# EAGLE schematic octanis_eps_compact (EAGLE 7.1.0)
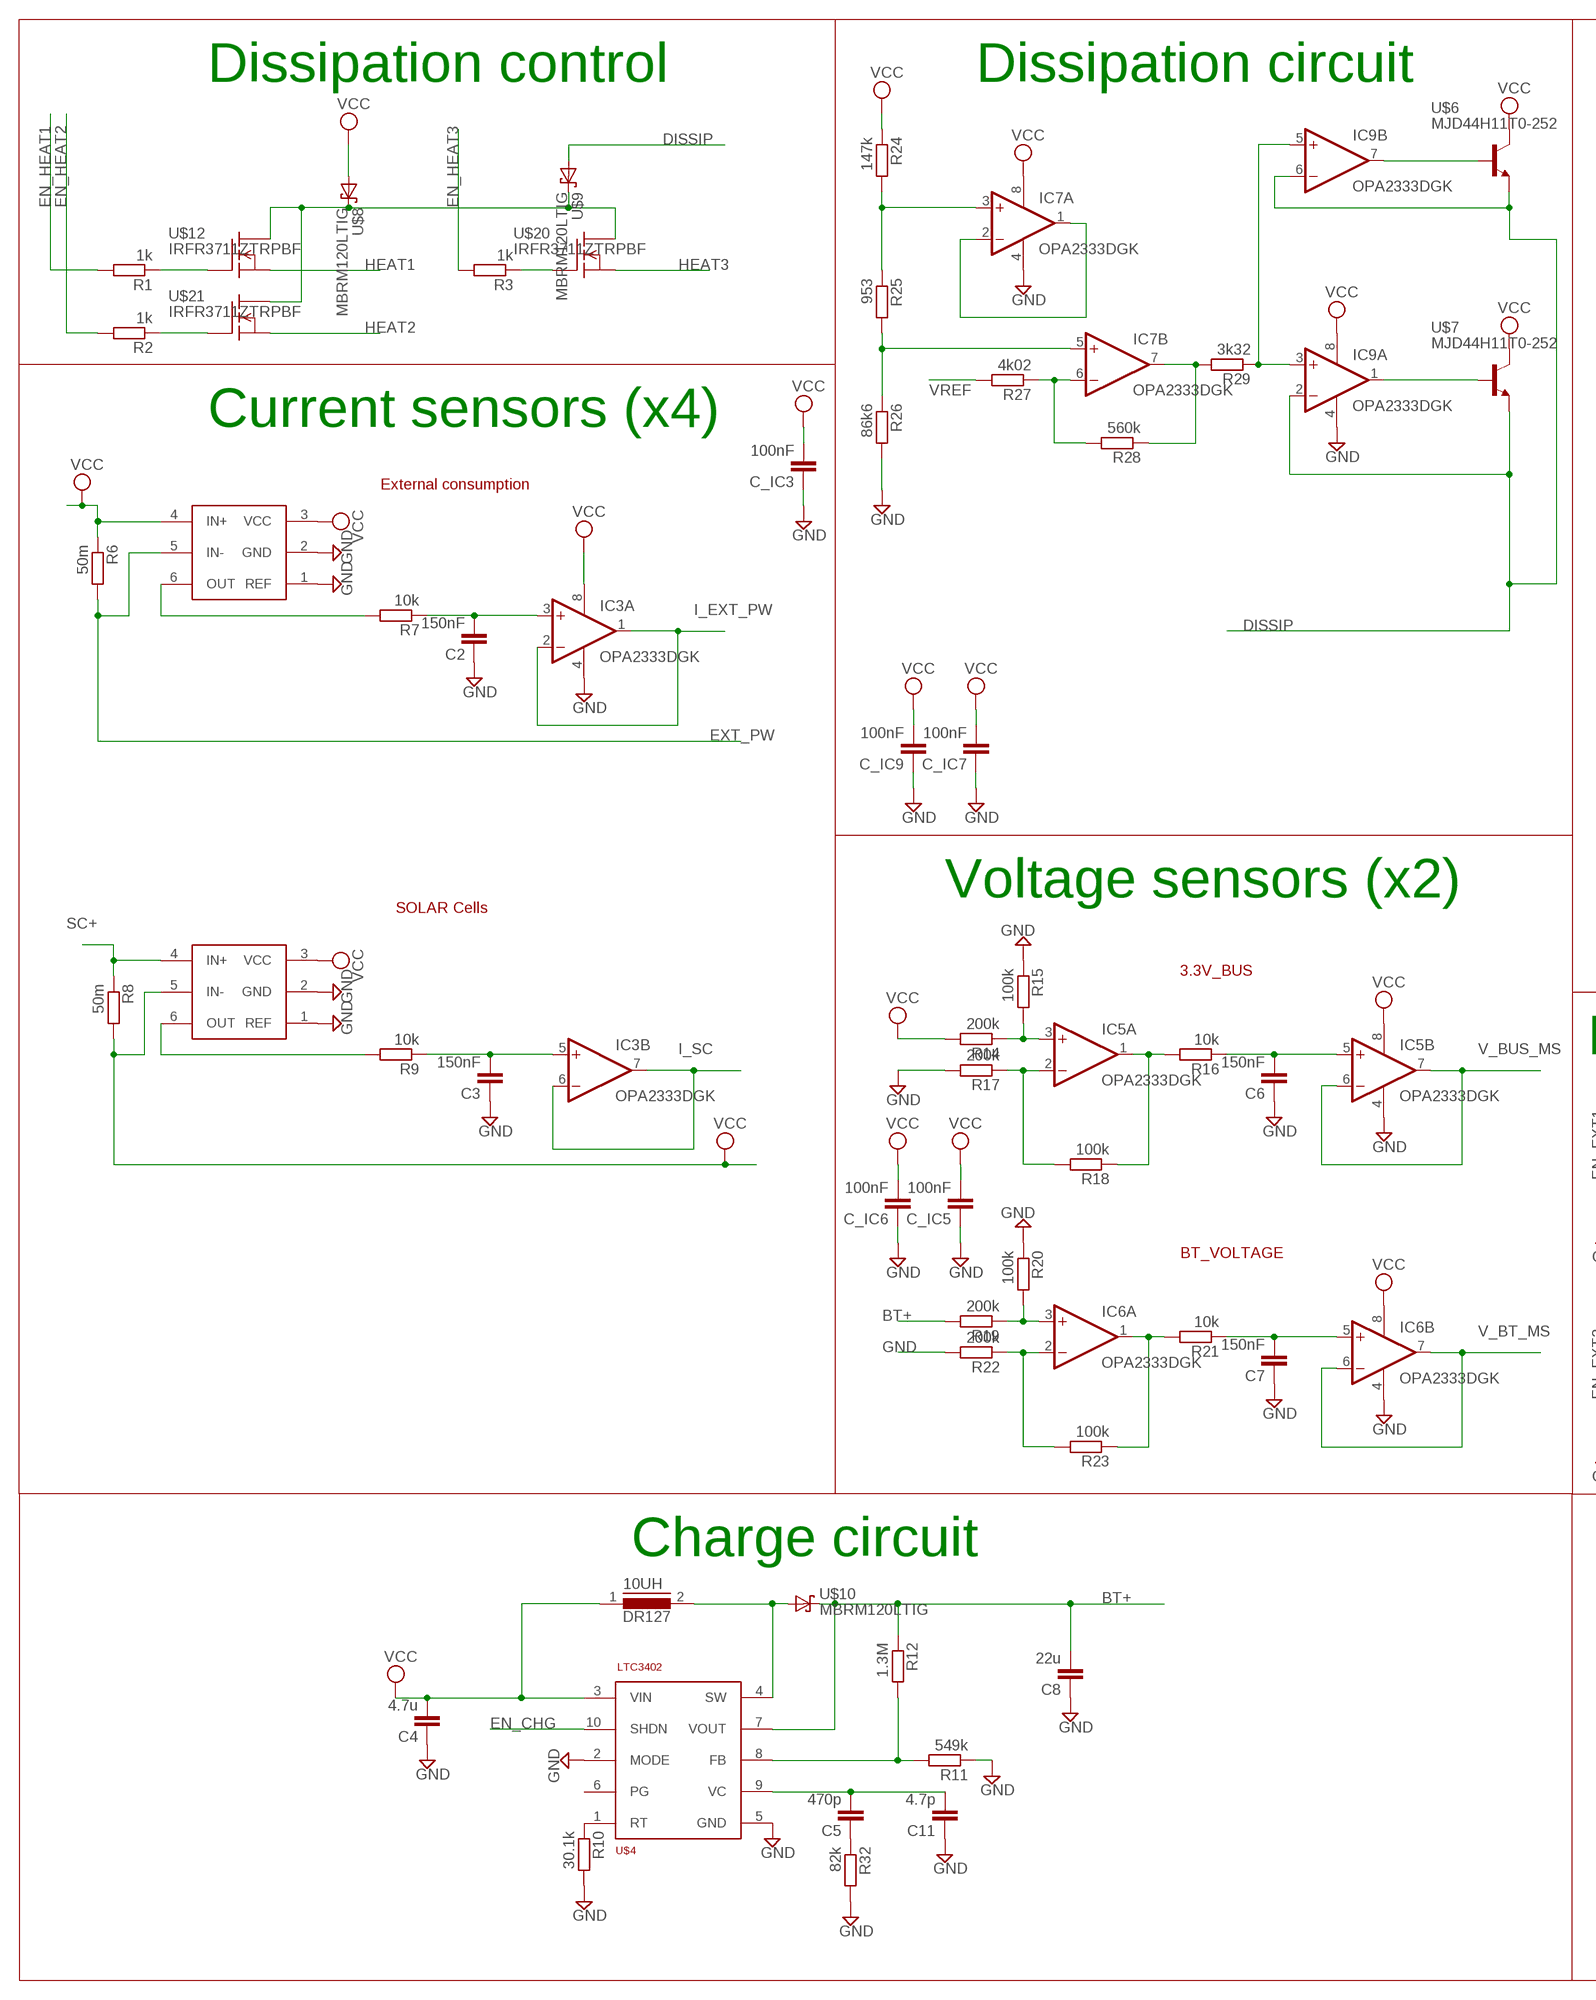
[diagram p0: schematic, sheet 1, part 1 of 2]
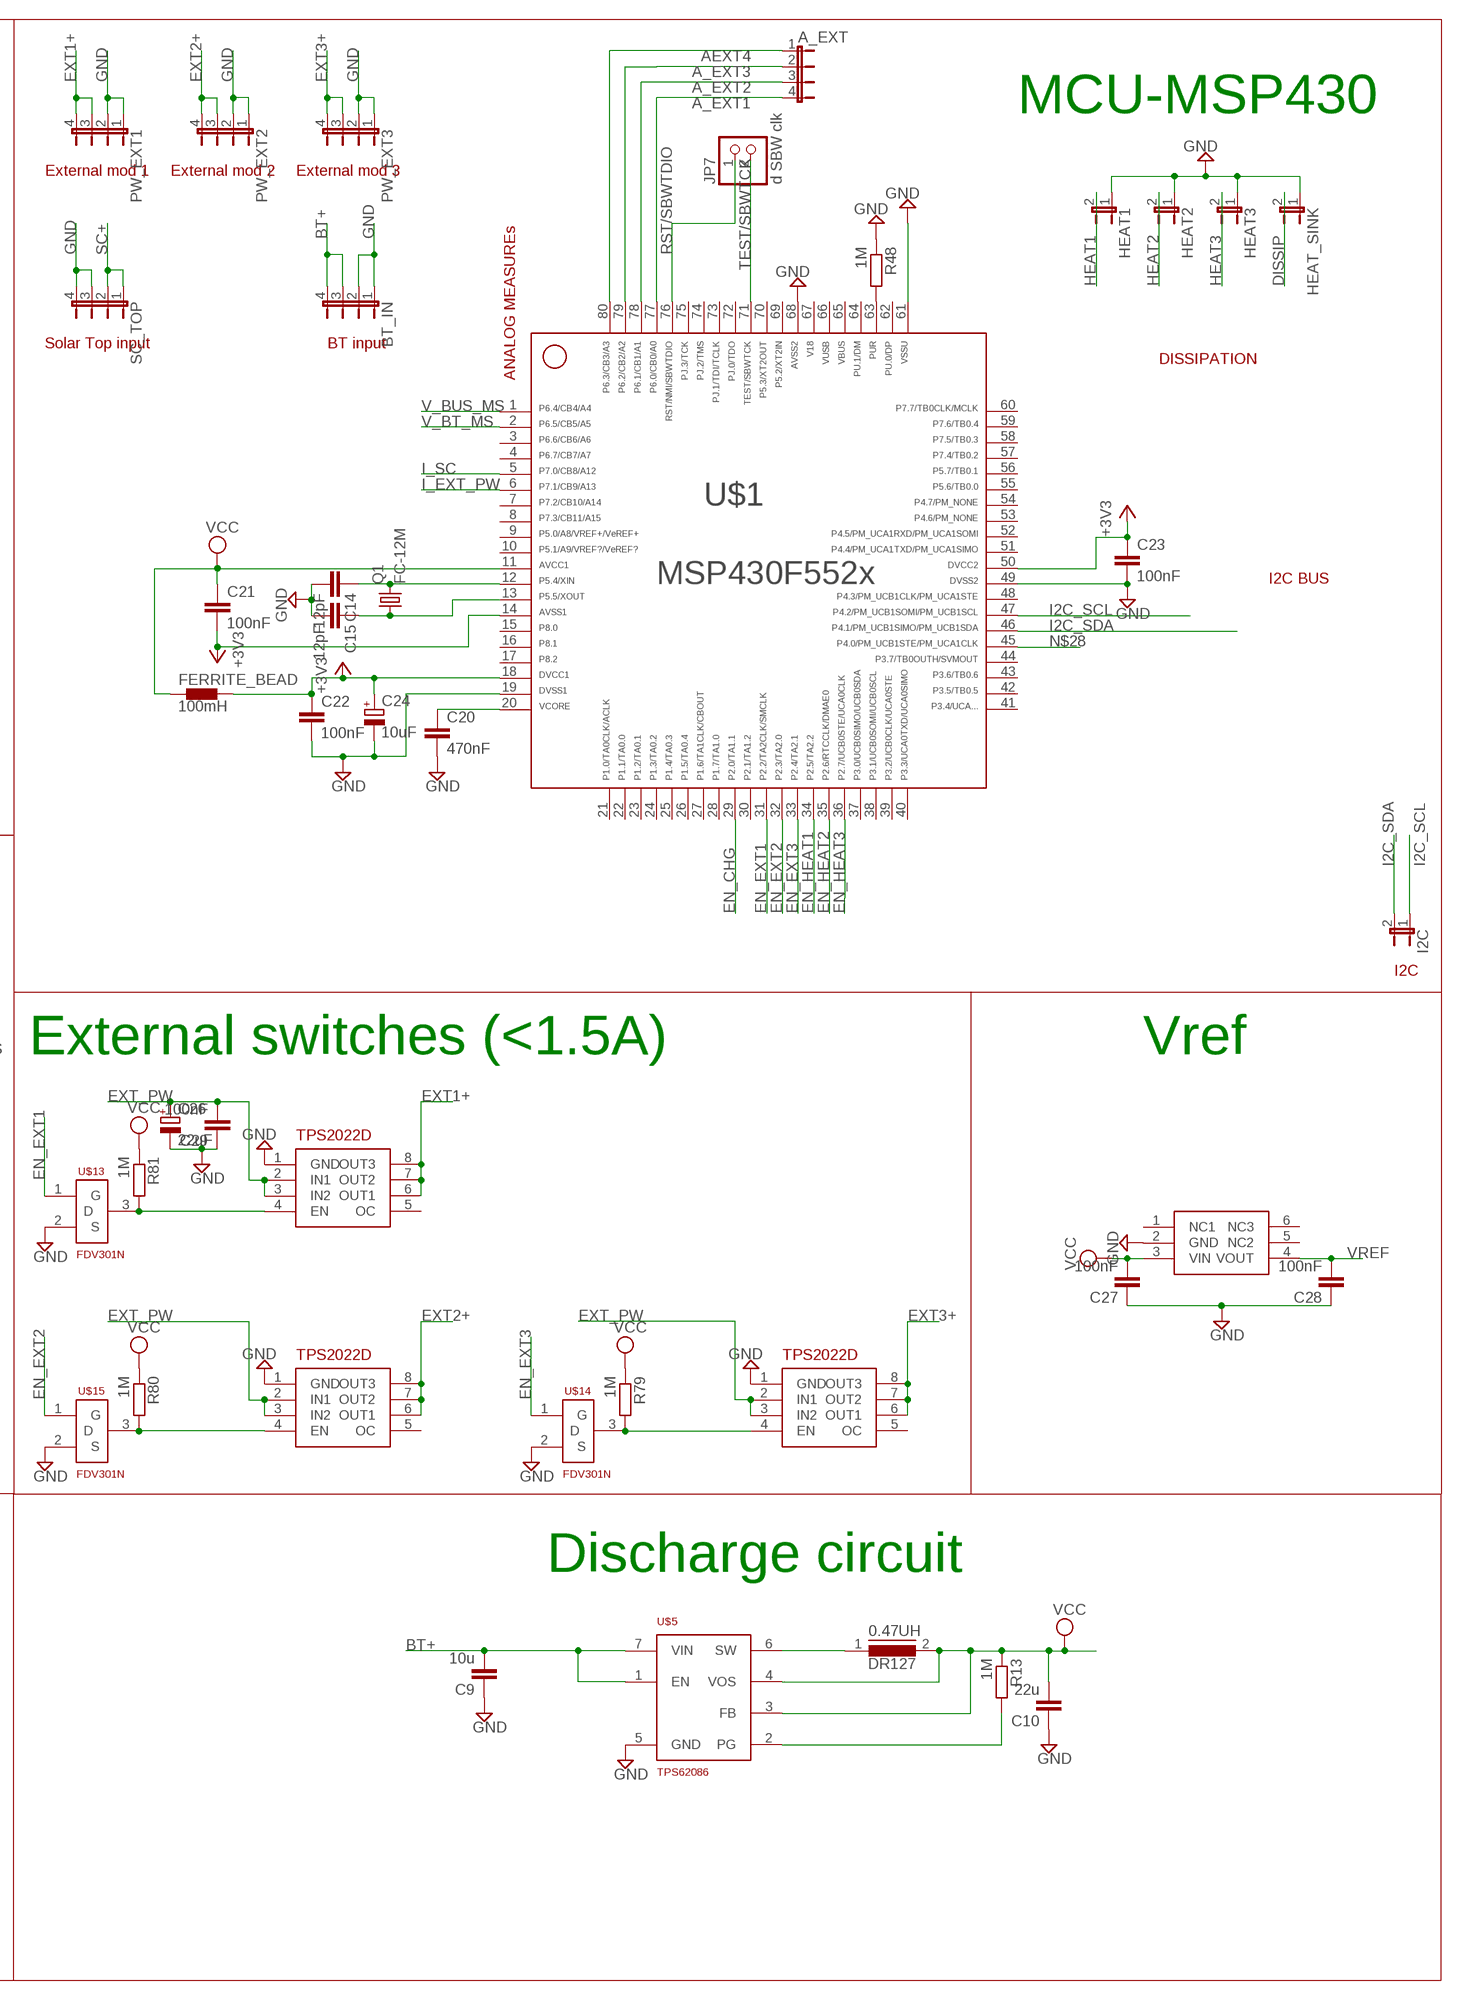
[diagram p1: schematic, sheet 1, part 2 of 2]

## Parts
0.47UH  DR127  [DR127]
10UH  DR127  [DR127]
A_EXT  JP4E  [JP4]
BT_IN  JP4E  [JP4]
C2  150nF  C-EUC0603  [C0603]
C3  150nF  C-EUC0603  [C0603]
C4  4.7u  C-EUC0603  [C0603]
C5  470p  C-EUC0603  [C0603]
C6  150nF  C-EUC0603  [C0603]
C7  150nF  C-EUC0603  [C0603]
C8  22u  C-EUC0603  [C0603]
C9  10u  C-EUC0603  [C0603]
C10  22u  C-EUC0603  [C0603]
C11  4.7p  C-EUC0603  [C0603]
C14  12pF  C-EUC0603  [C0603]
C15  12pF  C-EUC0603  [C0603]
C20  470nF  C-EUC0603  [C0603]
C21  100nF  C-EUC0603  [C0603]
C22  100nF  C-EUC0603  [C0603]
C23  100nF  C-EUC0603  [C0603]
C24  10uF  CPOL-EUA/3216-18R  [A/3216-18R]
C26  22uF  CPOL-EUA/3216-18R  [A/3216-18R]
C27  100nF  C-EUC0603  [C0603]
C28  100nF  C-EUC0603  [C0603]
C29  100nF  C-EUC0603  [C0603]
C_IC3  100nF  C-EUC0603  [C0603]
C_IC5  100nF  C-EUC0603  [C0603]
C_IC6  100nF  C-EUC0603  [C0603]
C_IC7  100nF  C-EUC0603  [C0603]
C_IC9  100nF  C-EUC0603  [C0603]
FERRITE_BEAD  100mH  BLM15HD601SN1  [0402]
HEAT1  JP1E  [JP1]
HEAT2  JP1E  [JP1]
HEAT3  JP1E  [JP1]
HEAT_SINK  JP1E  [JP1]
I2C  JP1E  [JP1]
IC3  OPA2333DGK  [MSOP08]
IC5  OPA2333DGK  [MSOP08]
IC6  OPA2333DGK  [MSOP08]
IC7  OPA2333DGK  [MSOP08]
IC9  OPA2333DGK  [MSOP08]
JP7  d SBW clk  PINHD-1X2  [1X02]
PW_EXT1  JP4E  [JP4]
PW_EXT2  JP4E  [JP4]
PW_EXT3  JP4E  [JP4]
Q1  FC-12M  [FC-12M]
R1  1k  R-EU_R0603  [R0603]
R2  1k  R-EU_R0603  [R0603]
R3  1k  R-EU_R0603  [R0603]
R6  50m  R-EU_R1206  [R1206]
R7  10k  R-EU_R0603  [R0603]
R8  50m  R-EU_R1206  [R1206]
R9  10k  R-EU_R0603  [R0603]
R10  30.1k  R-EU_R0603  [R0603]
R11  549k  R-EU_R0603  [R0603]
R12  1.3M  R-EU_R0603  [R0603]
R13  1M  R-EU_R0603  [R0603]
R14  200k  R-EU_R0603  [R0603]
R15  100k  R-EU_R0603  [R0603]
R16  10k  R-EU_R0603  [R0603]
R17  200k  R-EU_R0603  [R0603]
R18  100k  R-EU_R0603  [R0603]
R19  200k  R-EU_R0603  [R0603]
R20  100k  R-EU_R0603  [R0603]
R21  10k  R-EU_R0603  [R0603]
R22  200k  R-EU_R0603  [R0603]
R23  100k  R-EU_R0603  [R0603]
R24  147k  R-EU_R0603  [R0603]
R25  953  R-EU_R0603  [R0603]
R26  86k6  R-EU_R0603  [R0603]
R27  4k02  R-EU_R0603  [R0603]
R28  560k  R-EU_R0603  [R0603]
R29  3k32  R-EU_R0603  [R0603]
R32  82k  R-EU_R0603  [R0603]
R48  1M  R-EU_R0603  [R0603]
R79  1M  R-EU_R0603  [R0603]
R80  1M  R-EU_R0603  [R0603]
R81  1M  R-EU_R0603  [R0603]
SC_TOP  JP4E  [JP4]
U$1  F552X---PN80  [PN80]
U$2  INA213  [SC70-6]
U$3  INA213  [SC70-6]
U$4  LTC3402  [MSOP10]
U$5  TPS62086  [QFN-7]
U$6  MJD44H11T0-252  [TO252]
U$7  MJD44H11T0-252  [TO252]
U$8  MBRM120LTIG  [DO216AA]
U$9  MBRM120LTIG  [DO216AA]
U$10  MBRM120LTIG  [DO216AA]
U$12  IRFR3711ZTRPBF  [TO252]
U$13  FDV301N  [SOT23]
U$14  FDV301N  [SOT23]
U$15  FDV301N  [SOT23]
U$16  TPS2022D  [SO8]
U$17  TPS2022D  [SO8]
U$18  TPS2022D  [SO8]
U$19  ADR127B  [TSOT23-6]
U$20  IRFR3711ZTRPBF  [TO252]
U$21  IRFR3711ZTRPBF  [TO252]

## Nets
+3V3: C21.2 C22.1 C23.1 C24.+ FERRITE_BEAD.2 U$1.14 U$1.18 U$1.50
A_EXT1: A_EXT.4 U$1.77
A_EXT2: A_EXT.3 U$1.78
A_EXT3: A_EXT.2 U$1.79
AEXT4: A_EXT.1 U$1.80
BT+: BT_IN.3 BT_IN.4 C8.2 C9.2 R12.1 R19.2 U$4.7(VOUT) U$5.1(EN) U$5.7(VIN) U$10.C(K)
DISSIP: HEAT_SINK.2 IC9.2(A:-IN) IC9.6(B:-IN) U$6.3(E) U$7.3(E) U$8.C(K) U$9.A U$9.C(K) U$12.2(D) U$20.2(D) U$21.2(D)
EN_CHG: U$1.29 U$4.10(SHDN)
EN_EXT1: U$1.31 U$13.1(G)
EN_EXT2: U$1.32 U$15.1(G)
EN_EXT3: U$1.33 U$14.1(G)
EN_HEAT1: R1.2 U$1.34
EN_HEAT2: R2.2 U$1.35
EN_HEAT3: R3.2 U$1.36
EXT1+: PW_EXT1.3 PW_EXT1.4 U$16.6(OUT1) U$16.7(OUT2) U$16.8(OUT3)
EXT2+: PW_EXT2.3 PW_EXT2.4 U$17.6(OUT1) U$17.7(OUT2) U$17.8(OUT3)
EXT3+: PW_EXT3.3 PW_EXT3.4 U$18.6(OUT1) U$18.7(OUT2) U$18.8(OUT3)
EXT_PW: C26.+ C29.2 R6.2 U$2.5(IN-) U$16.2(IN1) U$16.3(IN2) U$17.2(IN1) U$17.3(IN2) U$18.2(IN1) U$18.3(IN2)
GND: BT_IN.1 BT_IN.2 C2.1 C3.1 C4.1 C6.1 C7.1 C8.1 C9.1 C10.1 C11.1 C14.2 C15.2 C20.2 C22.2 C23.2 C24.- C26.- C27.1 C28.1 C29.1 C_IC3.1 C_IC5.1 C_IC6.1 C_IC7.1 C_IC9.1 HEAT1.1 HEAT2.1 HEAT3.1 HEAT_SINK.1 IC3.4(P:V-) IC5.4(P:V-) IC6.4(P:V-) IC7.4(P:V-) IC9.4(P:V-) PW_EXT1.1 PW_EXT1.2 PW_EXT2.1 PW_EXT2.2 PW_EXT3.1 PW_EXT3.2 R10.2 R11.1 R15.1 R17.2 R20.1 R22.2 R26.2 R32.2 R48.1 SC_TOP.3 SC_TOP.4 U$1.19 U$1.49 U$1.61 U$1.68 U$2.1(REF) U$2.2(GND) U$3.1(REF) U$3.2(GND) U$4.2(MODE) U$4.5(GND) U$5.5(GND) U$13.2(S) U$14.2(S) U$15.2(S) U$16.1(GND) U$17.1(GND) U$18.1(GND) U$19.2(GND)
HEAT1: HEAT1.2 U$12.3(S)
HEAT2: HEAT2.2 U$21.3(S)
HEAT3: HEAT3.2 U$20.3(S)
I2C_SCL: I2C.1 U$1.47
I2C_SDA: I2C.2 U$1.46
I_EXT_PW: IC3.1(A:OUT) IC3.2(A:-IN) U$1.6
I_SC: IC3.6(B:-IN) IC3.7(B:OUT) U$1.5
N$1: R7.2 U$2.6(OUT)
N$2: R9.2 U$3.6(OUT)
N$3: R10.1 U$4.1(RT)
N$4: C5.1 R32.1
N$6: C2.2 IC3.3(A:+IN) R7.1
N$7: C3.2 IC3.5(B:+IN) R9.1
N$8: C5.2 C11.2 U$4.9(VC)
N$9: C7.2 IC6.5(B:+IN) R21.1
N$10: IC6.1(A:OUT) R21.2 R23.1
N$11: C6.2 IC5.5(B:+IN) R16.1
N$12: IC5.1(A:OUT) R16.2 R18.1
N$13: IC5.2(A:-IN) R17.1 R18.2
N$14: IC5.3(A:+IN) R14.1 R15.2
N$15: IC6.2(A:-IN) R22.1 R23.2
N$16: IC6.3(A:+IN) R19.1 R20.2
N$17: IC7.1(A:OUT) IC7.2(A:-IN)
N$18: IC7.3(A:+IN) R24.2 R25.1
N$19: IC7.5(B:+IN) R25.2 R26.1
N$20: IC7.6(B:-IN) R27.1 R28.2
N$21: IC7.7(B:OUT) R28.1 R29.2
N$22: IC9.3(A:+IN) IC9.5(B:+IN) R29.1
N$23: R11.2 R12.2 U$4.8(FB)
N$24: 10UH.2 U$4.4(SW) U$10.A
N$25: R13.2 U$5.2(PG)
N$26: 0.47UH.1 U$5.6(SW)
N$27: R48.2 U$1.63
N$28: U$1.45
N$29: R1.1 U$12.1(G)
N$30: IC9.7(B:OUT) U$6.1(B)
N$31: R2.1 U$21.1(G)
N$34: R80.2 U$15.3(D) U$17.4(EN)
N$37: R3.1 U$20.1(G)
N$45: IC9.1(A:OUT) U$7.1(B)
N$48: C14.1 Q1.2 U$1.12
N$49: C20.1 U$1.20
N$50: C15.1 Q1.1 U$1.13
N$79: R81.2 U$13.3(D) U$16.4(EN)
N$80: R79.2 U$14.3(D) U$18.4(EN)
RST/SBWTDIO: JP7.1 U$1.76
SC+: R8.1 SC_TOP.1 SC_TOP.2 U$3.4(IN+)
TEST/SBWTCK: JP7.2 U$1.71
V_BT_MS: IC6.6(B:-IN) IC6.7(B:OUT) U$1.2
V_BUS_MS: IC5.6(B:-IN) IC5.7(B:OUT) U$1.1
VCC: 0.47UH.2 10UH.1 C4.2 C10.2 C21.1 C27.2 C_IC3.2 C_IC5.2 C_IC6.2 C_IC7.2 C_IC9.2 FERRITE_BEAD.1 IC3.8(P:V+) IC5.8(P:V+) IC6.8(P:V+) IC7.8(P:V+) IC9.8(P:V+) R6.1 R8.2 R13.1 R14.2 R24.1 R79.1 R80.1 R81.1 U$1.11 U$2.3(VCC) U$2.4(IN+) U$3.3(VCC) U$3.5(IN-) U$4.3(VIN) U$5.3(FB) U$5.4(VOS) U$6.2(C) U$7.2(C) U$8.A U$19.3(VIN)
VREF: C28.2 R27.2 U$19.4(VOUT)
Unconnected: U$1.3 U$1.4 U$1.7 U$1.8 U$1.9 U$1.10 U$1.15 U$1.16 U$1.17 U$1.21 U$1.22 U$1.23 U$1.24 U$1.25 U$1.26 U$1.27 U$1.28 U$1.30 U$1.37 U$1.38 U$1.39 U$1.40 U$1.41 U$1.42 U$1.43 U$1.44 U$1.48 U$1.51 U$1.52 U$1.53 U$1.54 U$1.55 U$1.56 U$1.57 U$1.58 U$1.59 U$1.60 U$1.62 U$1.64 U$1.69 U$1.70 U$1.72 U$1.73 U$1.74 U$1.75 U$4.6(PG) U$16.5(OC) U$17.5(OC) U$18.5(OC) U$19.1(NC1) U$19.5(NC2) U$19.6(NC3)

## Notes on the sheet
- Dissipation control | Dissipation circuit
- MCU-MSP430
- External mod 1 | External mod 2 | External mod 3
- Solar Top input | BT input
- DISSIPATION
- ANALOG MEASUREs
- Current sensors (x4)
- External consumption
- I2C BUS
- Voltage sensors (x2)
- SOLAR Cells
- 3.3V_BUS | I2C
- External switches (<1.5A) | Vref
- BT_VOLTAGE
- Charge circuit | Discharge circuit

## Power pins joined to a net without a drawn wire
65: U$1.65
66: U$1.66
67: U$1.67

## Library data of the parts
0.47UH 10UH = inductors:DR127: High Power Density, High Efficiency, Shielded Inductors Source: coiltronics_dr_series.pdf
A_EXT BT_IN PW_EXT1-PW_EXT3 SC_TOP = jumper:JP4E: JUMPER
C2-C11 C14 C15 C20-C23 C27-C29 C_IC3 C_IC5-C_IC7 C_IC9 = rcl:C-EU: CAPACITOR, European symbol
C24 C26 = rcl:CPOL-EU: POLARIZED CAPACITOR, European symbol
FERRITE_BEAD = inductors:BLM15H: EMIFIL (R) Chip Ferrite Bead for GHz Noise Source: http://www.murata.com/ Ferrite Bead BLM15H.pdf
HEAT1-HEAT3 HEAT_SINK I2C = jumper:JP1E: JUMPER
IC3 IC5-IC7 IC9 = linear:OPA2333: DUAL 1.8V, microPOWER CMOS OPERATIONAL AMPLIFIERS Zerø-Drift Series Source: Texas Instruments (Burr-Brown) .. U11 opa333 Operational Amp.pdf
JP7 = pinhead:PINHD-1X2: PIN HEADER
Q1 = crystal:FC-12M: kHz RANGE CRYSTAL UNIT LOW PROFILE SMD Source: Epson Toyocom FC-12M.pdf
R1-R3 R6-R29 R32 R48 R79-R81 = rcl:R-EU_: RESISTOR, European symbol
U$1 = TI_MSP430_v16:F552X---PN80: ***MSP430F552X***PN80 http://www.ti.com/lit/gpn/msp430f5529 Rev1.0 06/2010 For F552X where X is 1,5,7,9
U$2 U$3 = Octanis1_EPS:INA213: Voltage Output, High or Low Side Measurement, Bi-Directional Zer ø -Drift Series Current-Shunt Monitor
U$4 = Octanis1_EPS:LTC3402: 1 LTC3402 3402fb 2A, 3MHz Micropower Synchronous Boost Converter
U$5 = Octanis1_EPS:TPS62086: 3-A Step-Down Converter with Hiccup Short Circuit Protection in 2x2 QFN Package Fixed 3.3V operation
U$6 U$7 = Octanis1_EPS:MJD44H11: MJD44H11, MJD45H11 Complementary power transistors
U$8-U$10 = Octanis1_EPS:MBRM120LTIG
U$12 U$20 U$21 = Octanis1_EPS:IRFR3711ZTRPBF
U$13-U$15 = Octanis1_EPS:FDV301N: FDV301N Digital FET ,N-Channel
U$16-U$18 = Octanis1_EPS:TPS2022D: TEXAS INSTRUMENTS - TPS2022D - IC, 1.5A PWR DIST SWITCH 8SOIC
U$19 = Octanis1_EPS:ADR127B: ANALOG DEVICES - ADR127BUJZ-REEL7 - VOLTAGE REFERENCE, SERIES, 3.3V, TSOT-6

## Net classes
0 default: clearance 0.205 mm